# EAGLE design 2021-01-21_HALO_RGB_Board-Autorouted (EAGLE 9.6.2)
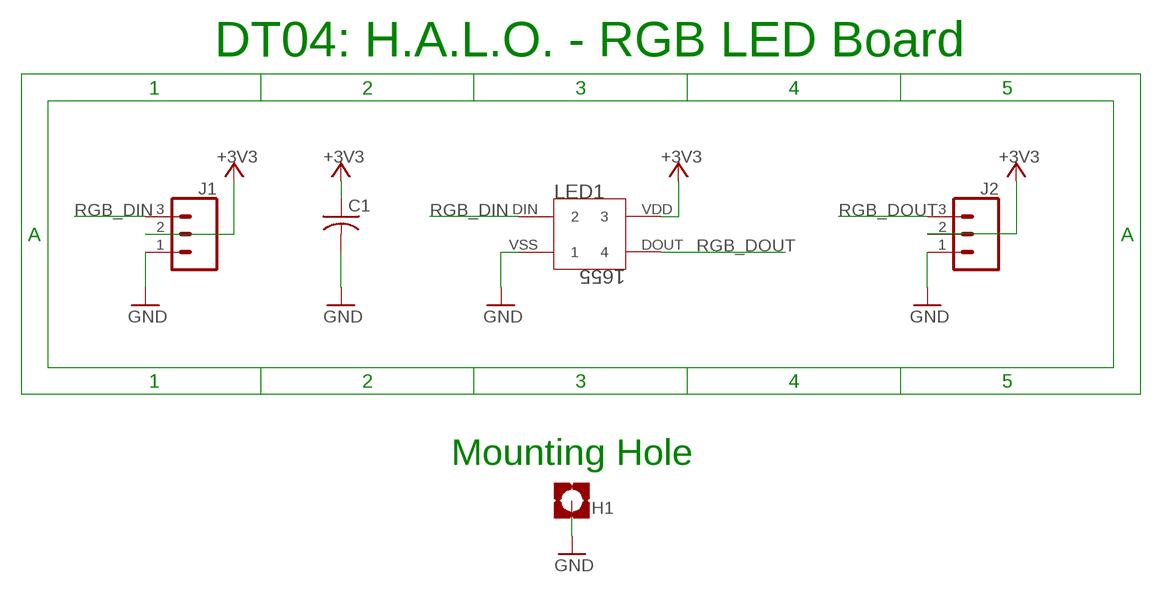
[diagram p0: schematic, sheet 1]

## Parts
C1  1uF  C-USC0805  [C0805]
H1  MOUNT-PAD-SQUARE3.0  [3,0-PAD-SQUARE]
J1  CONN_03LOCK  [1X03_LOCK]
J2  CONN_03LOCK  [1X03_LOCK]
LED1  1655  [LED_1655_ADA]

## Nets
+3V3: C1.1 J1.2 J2.2 LED1.VDD
GND: C1.2 H1.B3,0(MOUNT) J1.1 J2.1 LED1.VSS
RGB_DIN: J1.3 LED1.DIN
RGB_DOUT: J2.3 LED1.DOUT

## Notes on the sheet
- DT04: H.A.L.O. - RGB LED Board
- Mounting Hole

## Library data of the parts
C1 = rcl:C-US: CAPACITOR, American symbol
H1 = holes:MOUNT-PAD-SQUARE: MOUNTING PAD, square
J1 J2 = SparkFun-Connectors:CONN_03: Multi connection point. Often used as Generic Header-pin footprint for 0.1 inch spaced/style header connections On any of the 0.1 inch spaced packages, you can populate with these: Break Away Headers - Straight <https://www.sparkfun.com/products/116> (PRT-00116) Break Away Male Headers - Right Angle <https://www.sparkfun.com/products/553> (PRT-00553) Female Headers <https://www.sparkfun.com/products/115> (PRT-00115) Break Away Headers - Machine Pin <https://www.sparkfun.com/products/117> (PRT-00117) Break Away Female Headers - Swiss Machine Pin <https://www.sparkfun.com/products/743> (PRT-00743) Stackable Header - 3 Pin (Female, 0.1") <https://www.sparkfun.com/products/13875> (PRT-13875) For SCREWTERMINALS and SPRING TERMINALS visit here: Screw Terimnals on SparkFun.com <https://www.sparkfun.com/search/results?term=Screw+Terminals> (5mm/3.5mm/2.54mm spacing) This device is also useful as a general connection point to wire up your design to another part of your project. Our various solder wires solder well into these plated through hole pads. Hook-Up Wire - Assortment (Stranded, 22 AWG) <https://www.sparkfun.com/products/11375> (PRT-11375) Hook-Up Wire - Assortment (Solid Core, 22 AWG) <https://www.sparkfun.com/products/11367> (PRT-11367) View the entire wire category on our website here <https://www.sparkfun.com/categories/141> Special notes: Molex polarized connector foot print use with SKU : PRT-08232 with associated crimp pins and housings.
LED1 = HALO_RGB_LED:1655; BUILT_BY: EMA_Colton; COPYRIGHT: Copyright (C) 2018 Accelerated Designs. All rights reserved; MANUFACTURER_PART_NUMBER: 1655; SOURCELIBRARY: Adafruit_2019-12-18; VENDOR: Adafruit Industries

## Board
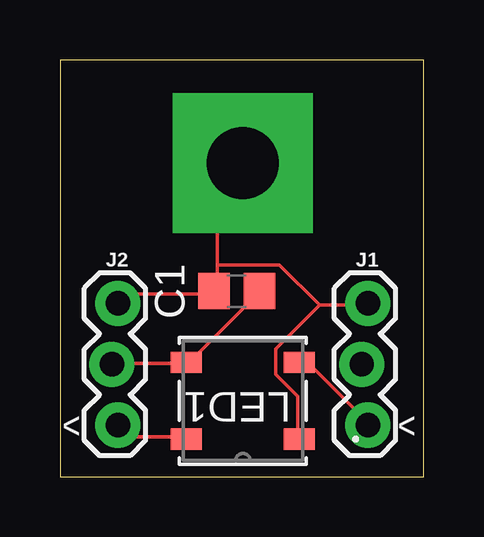
[diagram p1: board, top side]
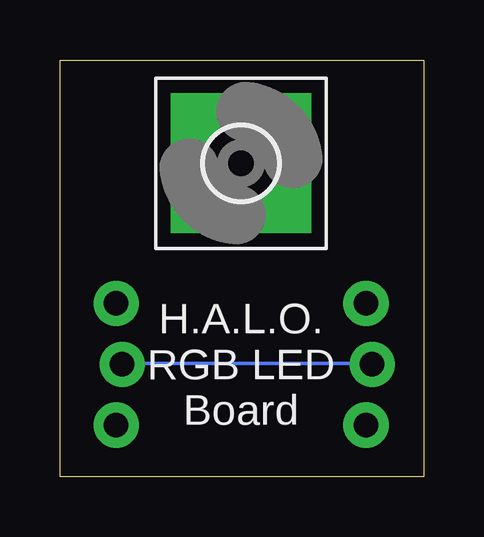
[diagram p2: board, bottom side, seen from below]

Size 15.16 x 17.39 mm. Coordinates in mm from the lower left corner, seen from the top.
Outline: 0,0 15.16,0 15.16,17.39 0,17.39 0,0
Copper layers (1*16): Top 0.035559375mm / dielectric 1.6mm / Bottom 0.035559375mm
Design rules "jlcpcb2layer": minimum track width 5mil, minimum drill 12mil, track to track 5mil, track to pad 5mil, pad to pad 5mil, via to via 5mil, smd to smd 5mil, copper to edge 8mil, drill to drill 6mil, minimum pad ring 5mil, minimum via ring 3mil, stop-mask expansion 2.5mil, vias tented up to drill 0mil, thermal gap 10mil

### Footprints (pad centres in the part's own frame; a part is rotated, then mirrored left to right if it is on the bottom)
C0805 = smd 1.3 x 1.5: 1 -0.95,0; 2 0.95,0
3,0-PAD-SQUARE = drill 3 pad 5.842 square: B3,0 0,0
1X03_LOCK = drill 1.016 pad 1.88: 1 0,0.127; 2 2.54,-0.127; 3 5.08,0.127
LED_1655_ADA = smd 1.295 x 0.889: DIN -2.357,-1.6; DOUT 2.357,1.6; VDD 2.357,-1.6; VSS -2.357,1.6

### Placement (x,y rotation side)
C1  7.37,7.75 180 top
H1  7.62,13.08 0 bottom
J1  12.7,7.24 270 top
J2  2.29,7.24 270 top
LED1  7.62,3.17 180 top

### Tracks (layer width: path | path; a pad name or v marks a point on that pad's centre or on a via)
+3V3
  Top 0.152: J2.2 2.29,4.72 5.18,4.72 LED1.VDD 5.33,4.72 8.23,7.62 C1.1
  Bottom 0.152: J1.2 12.5,4.72 2.29,4.72 J2.2
GND
  Top 0.152: 10.82,7.16 8.99,5.33 8.99,4.27 9.91,3.35 9.91,1.68 LED1.VSS | 10.82,7.16 12.8,7.16 J1.1 | J2.1 2.44,7.32 2.74,7.62 6.4,7.62 C1.2 6.55,7.77 6.55,8.84 | 6.55,8.84 6.55,11.89 7.62,12.95 H1.B3,0 | 10.82,7.16 9.14,8.84 6.55,8.84
RGB_DIN
  Top 0.152: LED1.DIN 10.06,4.72 10.36,4.72 12.8,2.29 J1.3
RGB_DOUT
  Top 0.152: J2.3 2.9,1.68 5.18,1.68 LED1.DOUT

### Text on the board
tNames: ^ | ^
bNames: H.A.L.O. / RGB LED / Board